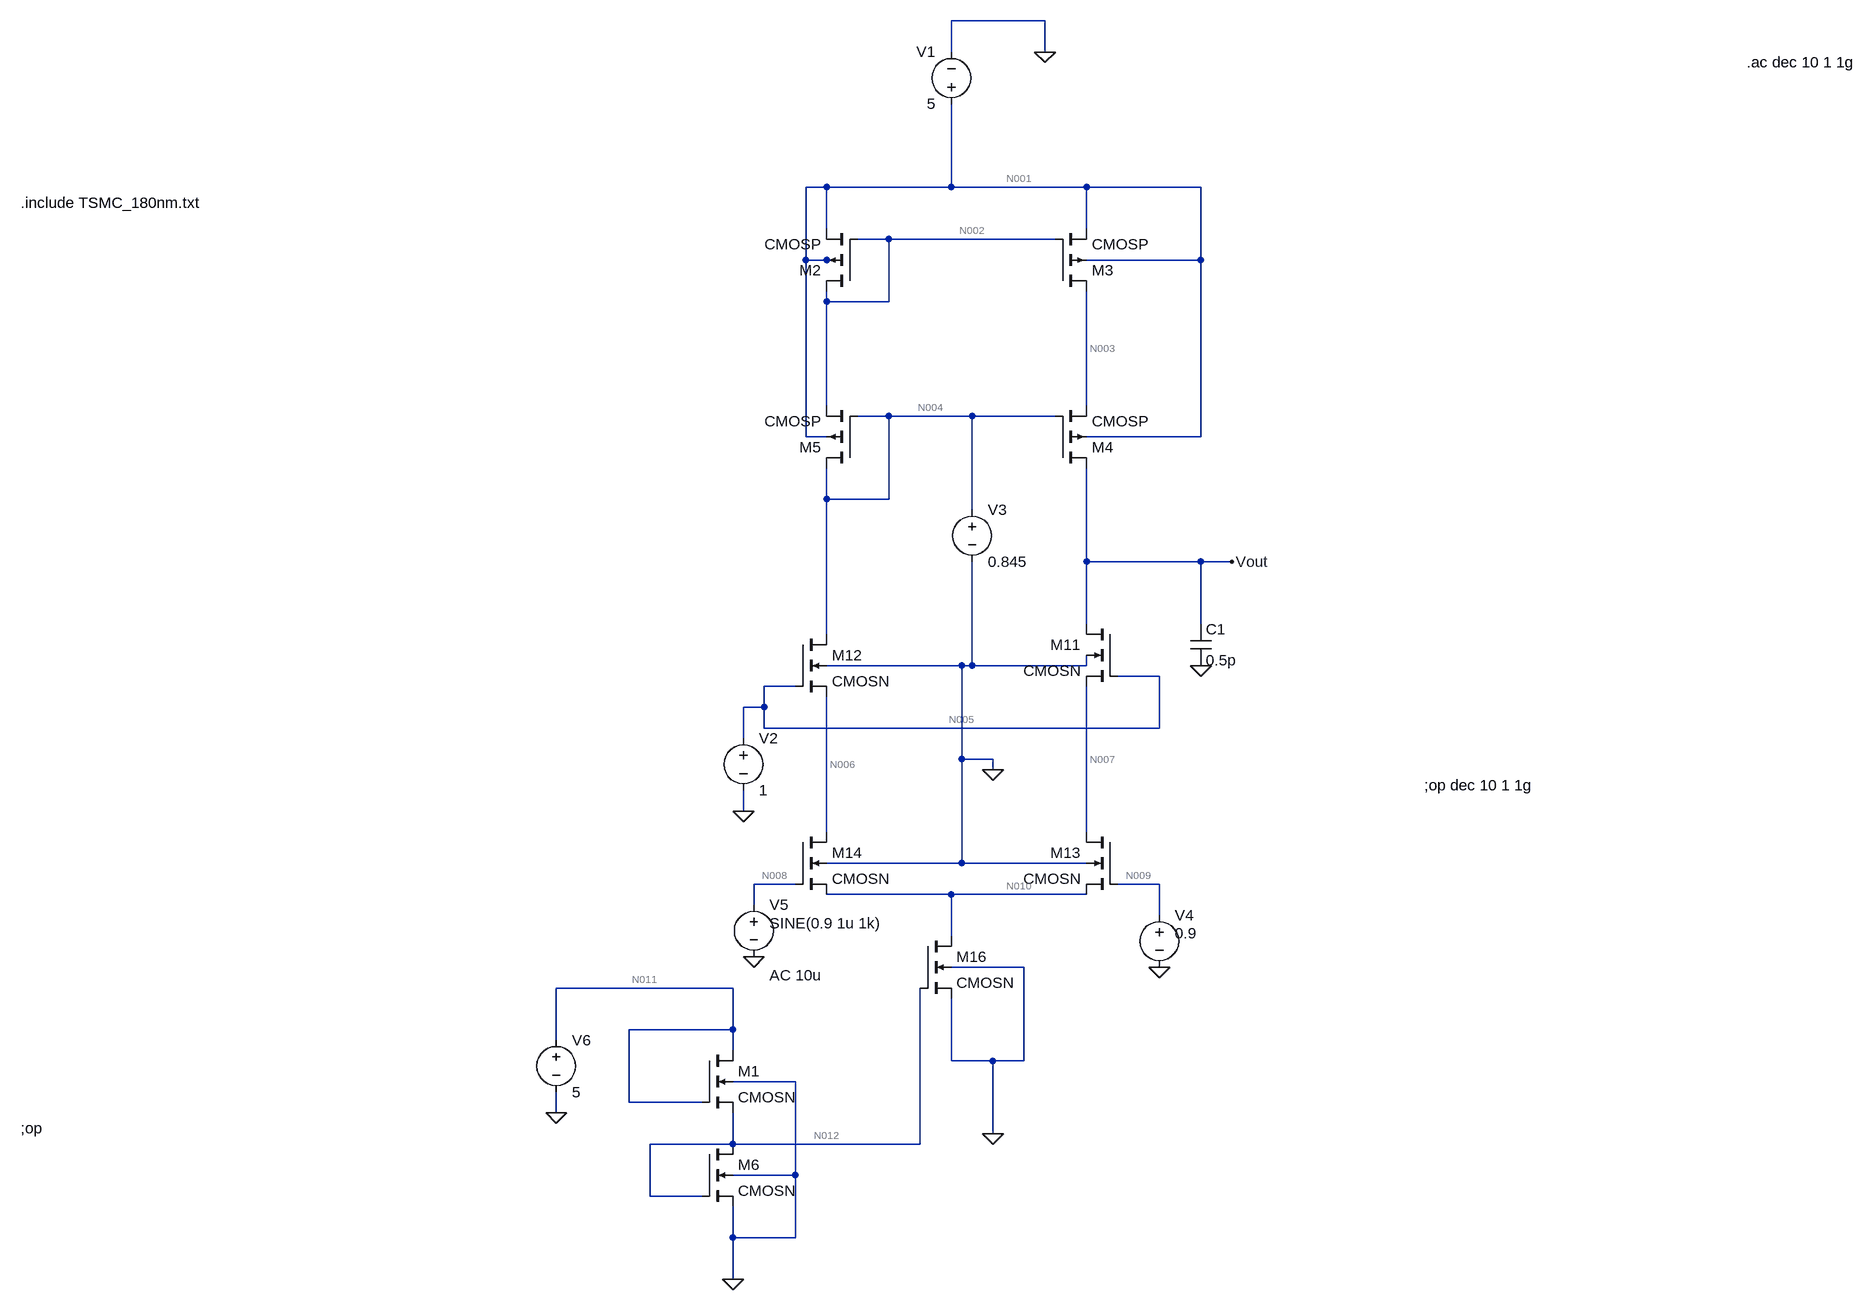
[diagram p0: schematic ques_4.asc]
ques_4.asc, the LTspice schematic file:
Version 4
SHEET 1 2176 1012
WIRE 288 -944 144 -944
WIRE 144 -896 144 -944
WIRE 288 -896 288 -944
WIRE -48 -688 -80 -688
WIRE 144 -688 144 -816
WIRE 144 -688 -48 -688
WIRE 352 -688 144 -688
WIRE 528 -688 352 -688
WIRE -48 -624 -48 -688
WIRE 352 -624 352 -688
WIRE 48 -608 0 -608
WIRE 304 -608 48 -608
WIRE -80 -576 -80 -688
WIRE -48 -576 -80 -576
WIRE -32 -576 -48 -576
WIRE 528 -576 528 -688
WIRE 528 -576 352 -576
WIRE -48 -512 -48 -528
WIRE 48 -512 48 -608
WIRE 48 -512 -48 -512
WIRE -48 -352 -48 -512
WIRE 352 -352 352 -528
WIRE 48 -336 0 -336
WIRE 176 -336 48 -336
WIRE 304 -336 176 -336
WIRE -80 -304 -80 -576
WIRE -48 -304 -80 -304
WIRE 528 -304 528 -576
WIRE 528 -304 352 -304
WIRE -48 -208 -48 -256
WIRE 48 -208 48 -336
WIRE 48 -208 -48 -208
WIRE 176 -192 176 -336
WIRE 352 -112 352 -256
WIRE 528 -112 352 -112
WIRE 576 -112 528 -112
WIRE 352 -16 352 -112
WIRE 528 -16 528 -112
WIRE -48 0 -48 -208
WIRE 160 48 -48 48
WIRE 176 48 176 -112
WIRE 176 48 160 48
WIRE 352 48 352 32
WIRE 352 48 176 48
WIRE 464 64 400 64
WIRE -96 80 -144 80
WIRE -144 112 -144 80
WIRE -144 112 -176 112
WIRE -144 144 -144 112
WIRE 464 144 464 64
WIRE 464 144 -144 144
WIRE -176 160 -176 112
WIRE 160 192 160 48
WIRE 208 192 160 192
WIRE 208 208 208 192
WIRE -176 272 -176 240
WIRE -48 304 -48 96
WIRE 352 304 352 80
WIRE 160 352 160 192
WIRE 160 352 -48 352
WIRE 352 352 160 352
WIRE -96 384 -160 384
WIRE 464 384 400 384
WIRE 144 400 -48 400
WIRE 352 400 144 400
WIRE -160 416 -160 384
WIRE 464 432 464 384
WIRE 144 464 144 400
WIRE 256 512 144 512
WIRE -192 544 -464 544
WIRE -192 608 -192 544
WIRE -192 608 -352 608
WIRE -464 624 -464 544
WIRE -192 640 -192 608
WIRE 144 656 144 560
WIRE 208 656 144 656
WIRE 256 656 256 512
WIRE 256 656 208 656
WIRE -96 688 -192 688
WIRE -352 720 -352 608
WIRE -240 720 -352 720
WIRE -464 736 -464 704
WIRE 208 768 208 656
WIRE -192 784 -192 736
WIRE -192 784 -320 784
WIRE 96 784 96 544
WIRE 96 784 -192 784
WIRE -192 800 -192 784
WIRE -96 832 -96 688
WIRE -96 832 -192 832
WIRE -320 864 -320 784
WIRE -240 864 -320 864
WIRE -192 928 -192 880
WIRE -96 928 -96 832
WIRE -96 928 -192 928
WIRE -192 992 -192 928
FLAG 288 -896 0
FLAG 208 208 0
FLAG -176 272 0
FLAG -160 496 0
FLAG 464 512 0
FLAG 576 -112 Vout
FLAG 528 48 0
FLAG -192 992 0
FLAG -464 736 0
FLAG 208 768 0
SYMBOL voltage 144 -800 R180
WINDOW 0 24 96 Left 2
WINDOW 3 24 16 Left 2
WINDOW 123 0 0 Left 0
WINDOW 39 0 0 Left 0
SYMATTR InstName V1
SYMATTR Value 5
SYMBOL nmos4 400 -16 M0
SYMATTR InstName M11
SYMATTR Value2 l=2u w=395u
SYMATTR Value CMOSN
SYMBOL nmos4 -96 0 R0
SYMATTR InstName M12
SYMATTR Value2 l=2u w=395u
SYMATTR Value CMOSN
SYMBOL nmos4 400 304 M0
SYMATTR InstName M13
SYMATTR Value2 l=2u w=395u
SYMATTR Value CMOSN
SYMBOL nmos4 -96 304 R0
SYMATTR InstName M14
SYMATTR Value2 l=2u w=395u
SYMATTR Value CMOSN
SYMBOL nmos4 96 464 R0
SYMATTR InstName M16
SYMATTR Value2 l=2u w=30u
SYMATTR Value CMOSN
SYMBOL pmos4 0 -528 R180
SYMATTR InstName M2
SYMATTR Value2 l=2u w=606u
SYMATTR Value CMOSP
SYMBOL pmos4 304 -528 M180
SYMATTR InstName M3
SYMATTR Value2 l=2u w=606u
SYMATTR Value CMOSP
SYMBOL pmos4 304 -256 M180
SYMATTR InstName M4
SYMATTR Value2 l=2u w=606u
SYMATTR Value CMOSP
SYMBOL pmos4 0 -256 R180
SYMATTR InstName M5
SYMATTR Value2 l=2u w=606u
SYMATTR Value CMOSP
SYMBOL voltage -176 144 R0
WINDOW 123 0 0 Left 0
WINDOW 39 0 0 Left 0
SYMATTR InstName V2
SYMATTR Value 1
SYMBOL voltage 176 -208 R0
WINDOW 123 0 0 Left 0
WINDOW 39 0 0 Left 0
SYMATTR InstName V3
SYMATTR Value 0.845
SYMBOL voltage 464 416 R0
WINDOW 3 24 44 Left 2
WINDOW 123 24 124 Left 2
WINDOW 39 0 0 Left 0
SYMATTR Value 0.9
SYMATTR InstName V4
SYMBOL cap 512 -16 R0
SYMATTR InstName C1
SYMATTR Value 0.5p
SYMBOL voltage -160 400 R0
WINDOW 123 24 124 Left 2
WINDOW 39 0 0 Left 0
WINDOW 3 24 44 Left 2
SYMATTR Value2 AC 10u
SYMATTR Value SINE(0.9 1u 1k)
SYMATTR InstName V5
SYMBOL nmos4 -240 640 R0
SYMATTR InstName M1
SYMATTR Value CMOSN
SYMBOL nmos4 -240 784 R0
SYMATTR InstName M6
SYMATTR Value CMOSN
SYMBOL voltage -464 608 R0
WINDOW 123 0 0 Left 0
WINDOW 39 0 0 Left 0
SYMATTR InstName V6
SYMATTR Value 5
TEXT -1288 -664 Left 2 !.include TSMC_180nm.txt
TEXT 872 232 Left 2 !;op dec 10 1 1g
TEXT -1288 760 Left 2 !;op
TEXT 1368 -880 Left 2 !.ac dec 10 1 1g

The netlist it stands for:
* ques_4.asc
V1 N001 0 5
M11 Vout N005 N007 0 CMOSN l=2u w=395u
M12 N004 N005 N006 0 CMOSN l=2u w=395u
M13 N007 N009 N010 0 CMOSN l=2u w=395u
M14 N006 N008 N010 0 CMOSN l=2u w=395u
M16 N010 N012 0 0 CMOSN l=2u w=30u
M2 N002 N002 N001 N001 CMOSP l=2u w=606u
M3 N003 N002 N001 N001 CMOSP l=2u w=606u
M4 Vout N004 N003 N001 CMOSP l=2u w=606u
M5 N004 N004 N002 N001 CMOSP l=2u w=606u
V2 N005 0 1
V3 N004 0 0.845
V4 N009 0 0.9
C1 Vout 0 0.5p
V5 N008 0 SINE(0.9 1u 1k) AC 10u
M1 N011 N011 N012 0 CMOSN
M6 N012 N012 0 0 CMOSN
V6 N011 0 5
.model NMOS NMOS
.model PMOS PMOS
.lib standard.mos
.include TSMC_180nm.txt
;op dec 10 1 1g
;op
.ac dec 10 1 1g
.backanno
.end

* Results of the author's LTspice run, read from the files saved beside the schematic
* Operating Point, zero values left out:
*   V(n001) = 5 V
*   V(vout) = 4.957 V
*   V(n005) = 1 V
*   V(n007) = 354.6 mV
*   V(n004) = 845 mV
*   V(n006) = 340.2 mV
*   V(n009) = 900 mV
*   V(n010) = 243.1 mV
*   V(n008) = 900 mV
*   V(n012) = 2.132 V
*   V(n002) = 3.208 V
*   V(n003) = 4.972 V
*   V(n011) = 5 V
*   Id(M5) = -12.99 mA
*   Ib(M5) = 5.967 pA
*   Is(M5) = 12.99 mA
*   Id(M4) = -625.4 µA
*   Is(M4) = 625.4 µA
*   Id(M3) = -625.4 µA
*   Is(M3) = 625.4 µA
*   Id(M2) = -12.99 mA
*   Ib(M2) = 1.802 pA
*   Is(M2) = 12.99 mA
*   Id(M6) = 277.9 µA
*   Ib(M6) = -2.142 pA
*   Is(M6) = -277.9 µA
*   Id(M1) = 277.9 µA
*   Ib(M1) = -7.152 pA
*   Is(M1) = -277.9 µA
*   Id(M16) = 1.21 mA
*   Is(M16) = -1.21 mA
*   Id(M14) = 584.5 µA
*   Is(M14) = -584.5 µA
*   Id(M13) = 625.4 µA
*   Is(M13) = -625.4 µA
*   Id(M12) = 584.5 µA
*   Ib(M12) = -1.205 pA
*   Is(M12) = -584.5 µA
*   Id(M11) = 625.4 µA
*   Ib(M11) = -5.331 pA
*   Is(M11) = -625.4 µA
*   I(V6) = -277.9 µA
*   I(V3) = 12.41 mA
*   I(V1) = -13.62 mA
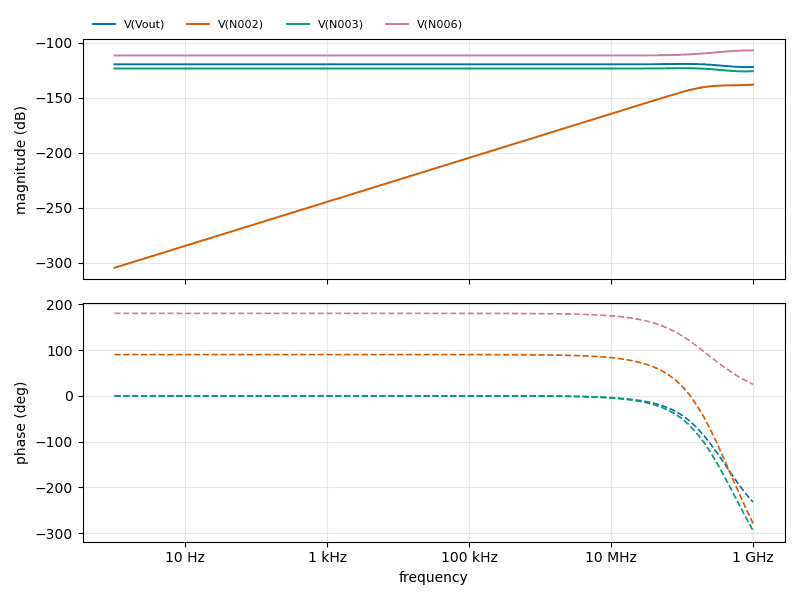
[diagram p1: AC Analysis of ques_4.asc, plotted from the saved traces]
* AC Analysis, 1 run:
*   V(Vout): -119.57 dB at 1 Hz, -121.98 dB at 1 GHz, peak -119.27 dB at 100 MHz
*   V(N002): -304.56 dB at 1 Hz, -138.02 dB at 1 GHz, peak -138.02 dB at 1 GHz, 3 dB below the peak at 175.4 MHz
*   V(N003): -123.39 dB at 1 Hz, -125.82 dB at 1 GHz, peak -123.12 dB at 100 MHz
*   V(N006): -111.51 dB at 1 Hz, -106.85 dB at 1 GHz, peak -106.85 dB at 1 GHz, 3 dB below the peak at 183.2 MHz